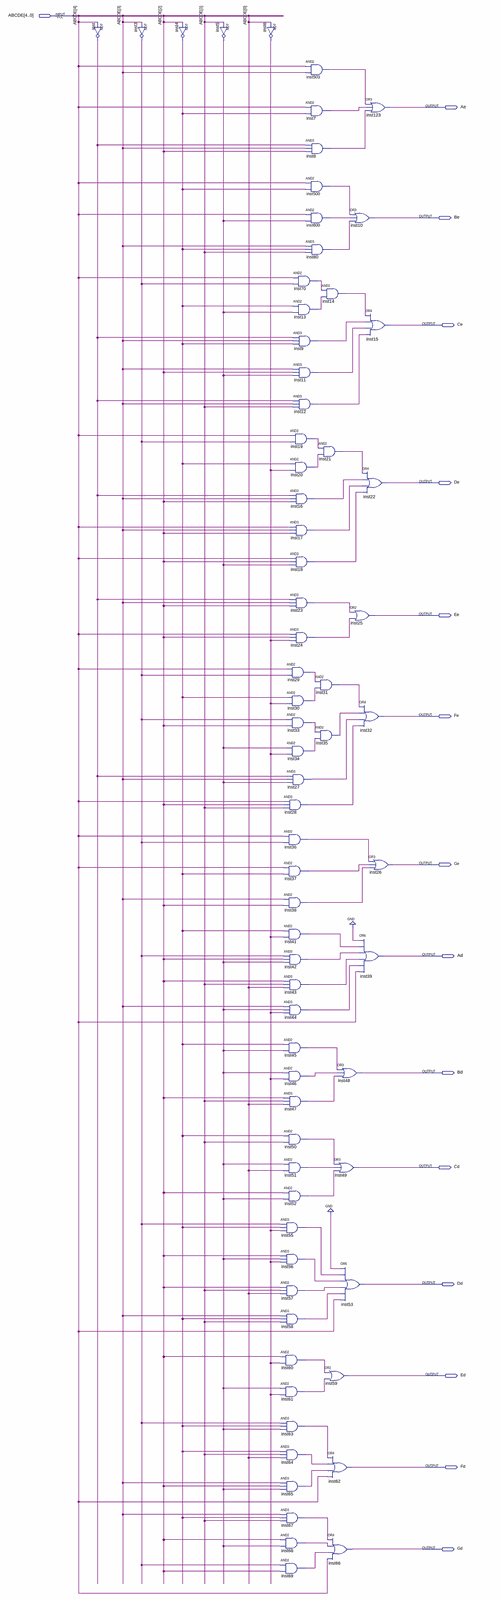
[diagram p0: schematic sheet, whole]
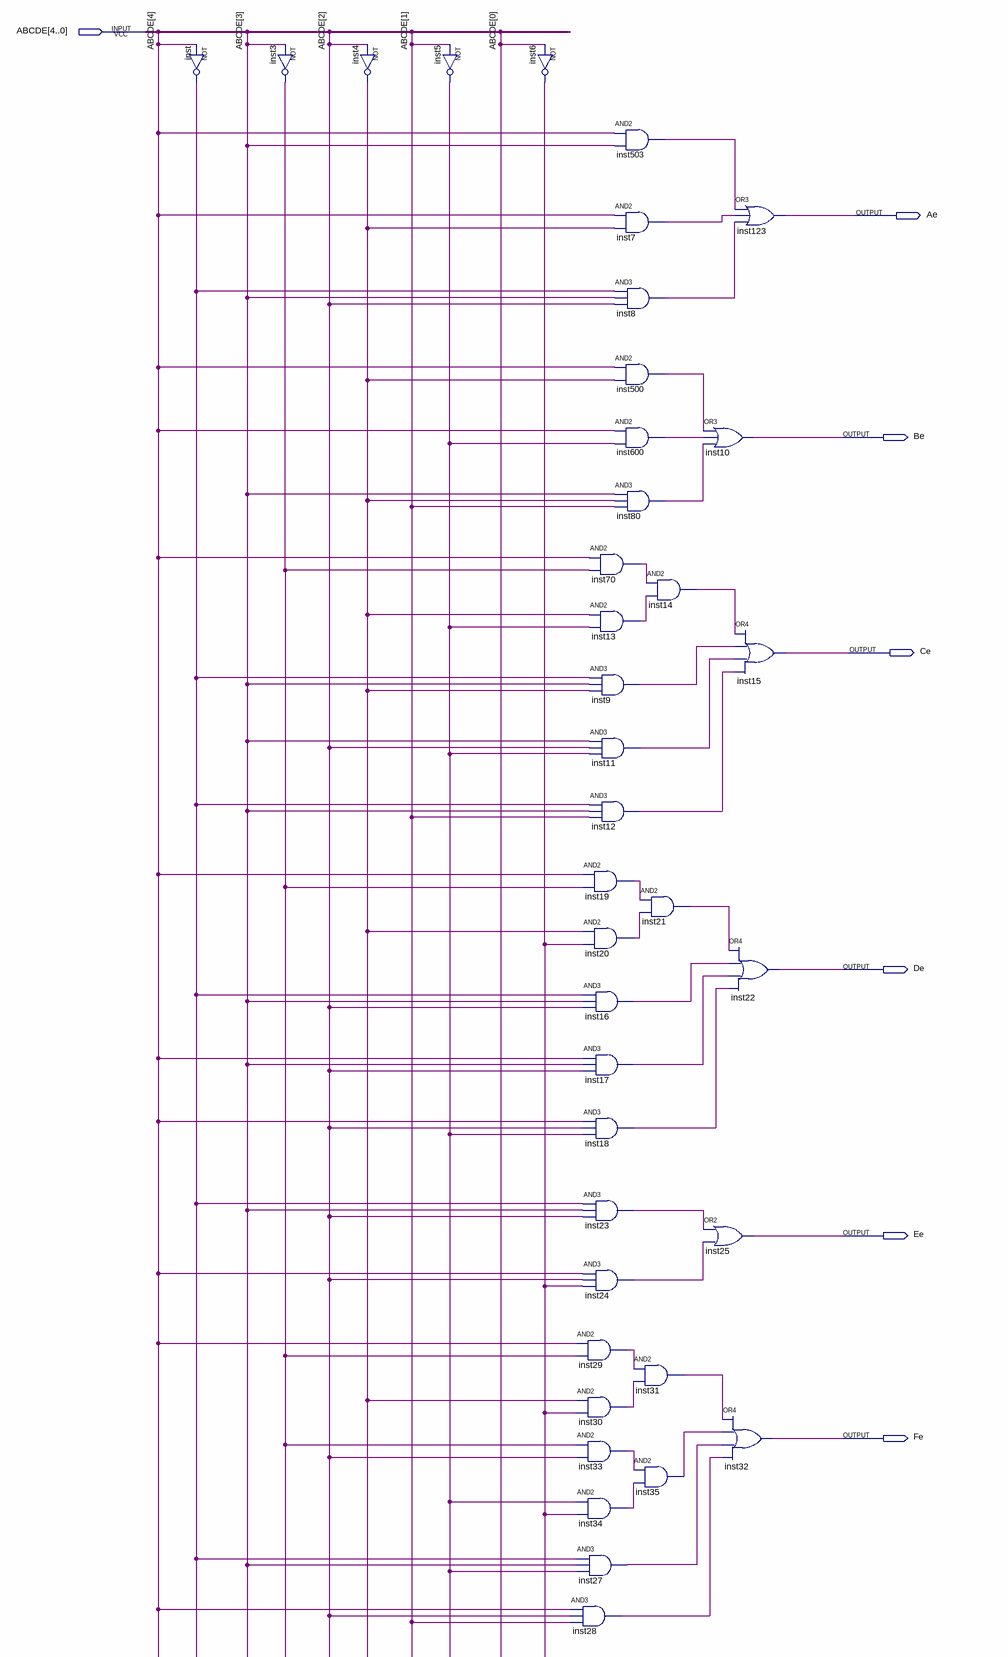
[diagram p1: schematic sheet, upper part]
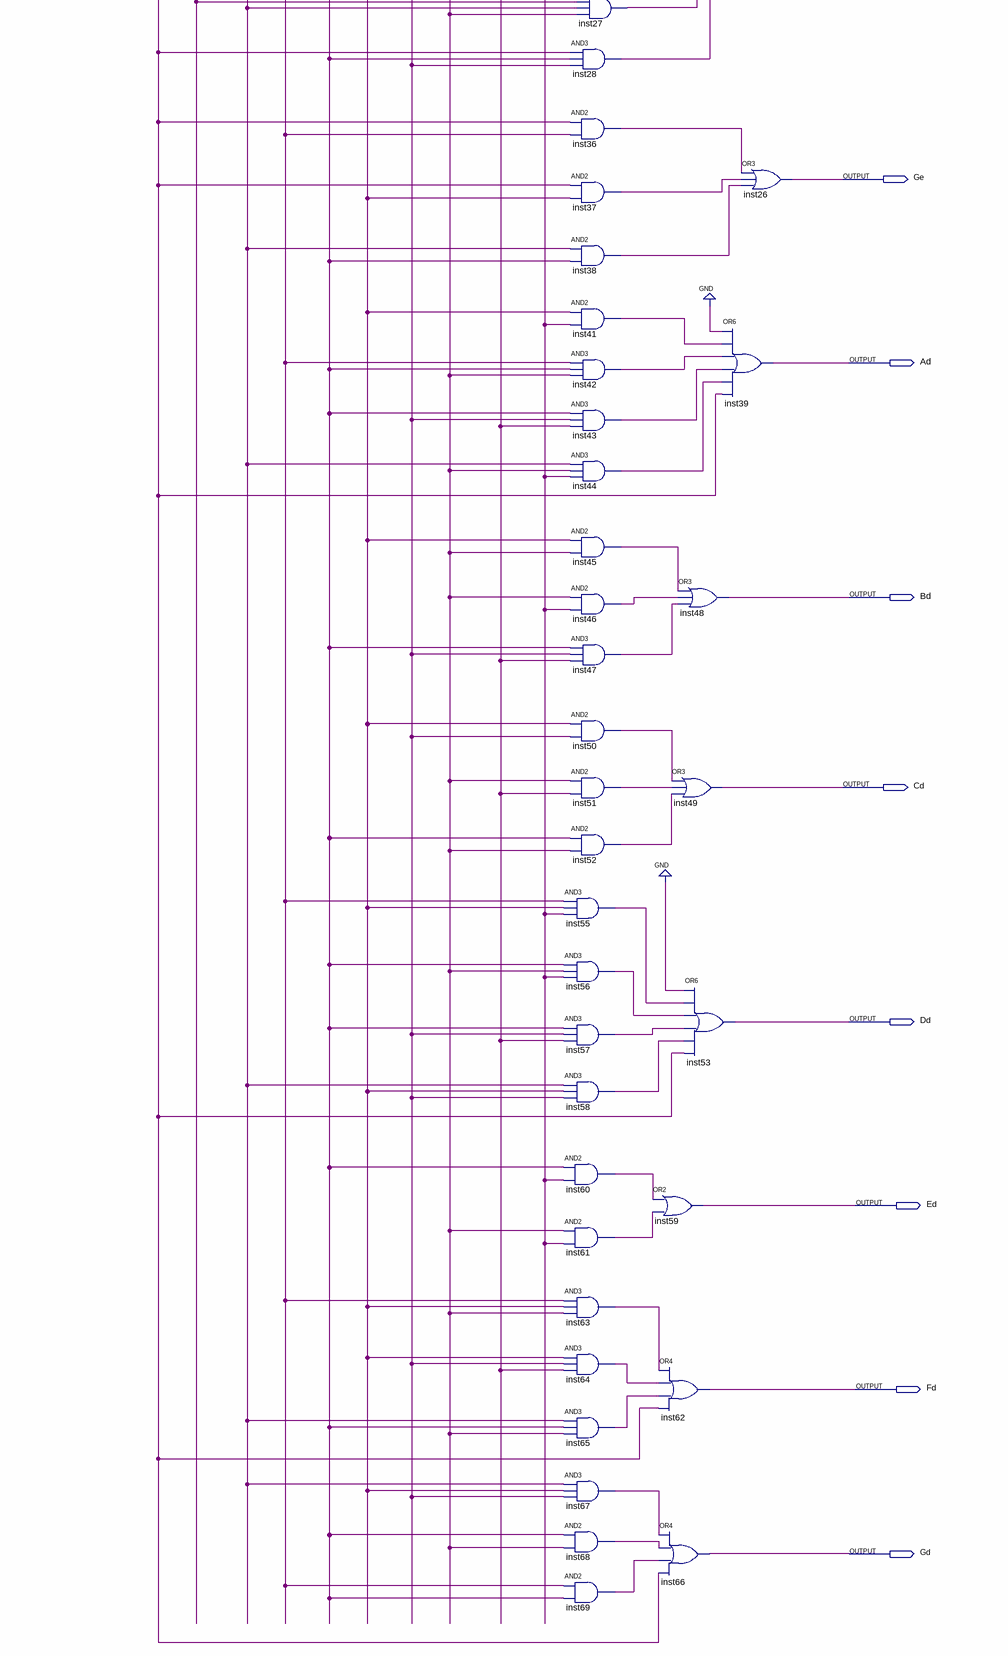
[diagram p2: schematic sheet, lower part]
// Quartus schematic DecodificadorDisplay.bdf as structural Verilog: 72 symbols, 15 pins
module DecodificadorDisplay (
  input  [4:0] ABCDE,
  output Ae,
  output Be,
  output Ce,
  output De,
  output Ee,
  output Fe,
  output Ge,
  output Ad,
  output Bd,
  output Cd,
  output Dd,
  output Ed,
  output Fd,
  output Gd
);

  wire inst3_out, inst4_out, inst5_out, inst6_out, inst7_out, inst8_out, inst9_out, inst11_out, inst12_out,
       inst13_out, inst14_out, inst16_out, inst17_out, inst18_out, inst19_out, inst20_out, inst21_out,
       inst23_out, inst24_out, inst27_out, inst28_out, inst29_out, inst30_out, inst31_out, inst33_out,
       inst34_out, inst35_out, inst36_out, inst37_out, inst38_out, inst41_out, inst42_out, inst43_out,
       inst44_out, inst45_out, inst46_out, inst47_out, inst50_out, inst51_out, inst52_out, inst55_out,
       inst56_out, inst57_out, inst58_out, inst60_out, inst61_out, inst63_out, inst64_out, inst65_out,
       inst67_out, inst68_out, inst69_out, inst70_out, inst80_out, inst500_out, inst503_out, inst600_out,
       inst_out;

  not inst (inst_out, ABCDE[4]);
  not inst3 (inst3_out, ABCDE[3]);
  not inst4 (inst4_out, ABCDE[2]);
  not inst5 (inst5_out, ABCDE[1]);
  not inst6 (inst6_out, ABCDE[0]);
  and inst70 (inst70_out, ABCDE[4], inst3_out);
  and inst13 (inst13_out, inst4_out, inst5_out);
  and inst9 (inst9_out, inst_out, ABCDE[3], inst4_out);
  and inst11 (inst11_out, ABCDE[3], ABCDE[2], inst5_out);
  and inst12 (inst12_out, inst_out, ABCDE[3], ABCDE[1]);
  and inst19 (inst19_out, ABCDE[4], inst3_out);
  and inst20 (inst20_out, inst4_out, inst6_out);
  and inst16 (inst16_out, inst_out, ABCDE[3], ABCDE[2]);
  and inst17 (inst17_out, ABCDE[4], ABCDE[3], ABCDE[2]);
  and inst18 (inst18_out, ABCDE[4], ABCDE[2], inst5_out);
  and inst23 (inst23_out, inst_out, ABCDE[3], ABCDE[2]);
  and inst24 (inst24_out, ABCDE[4], ABCDE[2], inst6_out);
  and inst29 (inst29_out, ABCDE[4], inst3_out);
  and inst30 (inst30_out, inst4_out, inst6_out);
  and inst33 (inst33_out, inst3_out, ABCDE[2]);
  and inst34 (inst34_out, inst5_out, inst6_out);
  and inst27 (inst27_out, inst_out, ABCDE[3], inst5_out);
  and inst28 (inst28_out, ABCDE[4], ABCDE[2], ABCDE[1]);
  and inst36 (inst36_out, ABCDE[4], inst3_out);
  and inst37 (inst37_out, ABCDE[4], inst4_out);
  and inst38 (inst38_out, ABCDE[3], ABCDE[2]);
  and inst41 (inst41_out, inst4_out, inst6_out);
  and inst42 (inst42_out, inst3_out, ABCDE[2], inst5_out);
  and inst43 (inst43_out, ABCDE[2], ABCDE[1], ABCDE[0]);
  and inst44 (inst44_out, ABCDE[3], inst5_out, inst6_out);
  and inst45 (inst45_out, inst4_out, inst5_out);
  and inst46 (inst46_out, inst5_out, inst6_out);
  and inst47 (inst47_out, ABCDE[2], ABCDE[1], ABCDE[0]);
  and inst50 (inst50_out, inst4_out, ABCDE[1]);
  and inst51 (inst51_out, inst5_out, ABCDE[0]);
  and inst52 (inst52_out, ABCDE[2], inst5_out);
  and inst55 (inst55_out, inst3_out, inst4_out, inst6_out);
  and inst56 (inst56_out, ABCDE[2], inst5_out, inst6_out);
  and inst57 (inst57_out, ABCDE[2], ABCDE[1], ABCDE[0]);
  and inst58 (inst58_out, ABCDE[3], inst4_out, ABCDE[1]);
  and inst60 (inst60_out, ABCDE[2], inst6_out);
  and inst61 (inst61_out, inst5_out, inst6_out);
  and inst63 (inst63_out, inst3_out, inst4_out, inst5_out);
  and inst64 (inst64_out, inst4_out, ABCDE[1], ABCDE[0]);
  and inst65 (inst65_out, ABCDE[3], ABCDE[2], inst5_out);
  and inst67 (inst67_out, ABCDE[3], inst4_out, ABCDE[1]);
  and inst68 (inst68_out, ABCDE[2], inst5_out);
  and inst69 (inst69_out, inst3_out, ABCDE[2]);
  and inst503 (inst503_out, ABCDE[4], ABCDE[3]);
  and inst7 (inst7_out, ABCDE[4], inst4_out);
  and inst8 (inst8_out, inst_out, ABCDE[3], ABCDE[2]);
  and inst500 (inst500_out, ABCDE[4], inst4_out);
  and inst600 (inst600_out, ABCDE[4], inst5_out);
  and inst80 (inst80_out, ABCDE[3], inst4_out, ABCDE[1]);
  and inst14 (inst14_out, inst70_out, inst13_out);
  and inst21 (inst21_out, inst19_out, inst20_out);
  and inst31 (inst31_out, inst29_out, inst30_out);
  and inst35 (inst35_out, inst33_out, inst34_out);
  or inst48 (Bd, inst45_out, inst46_out, inst47_out);
  or inst49 (Cd, inst50_out, inst51_out, inst52_out);
  or inst53 (Dd, 1'b0, inst55_out, inst56_out, inst57_out, inst58_out, ABCDE[4]);
  or inst59 (Ed, inst60_out, inst61_out);
  or inst62 (Fd, inst63_out, inst64_out, inst65_out, ABCDE[4]);
  or inst66 (Gd, inst67_out, inst68_out, inst69_out, ABCDE[4]);
  or inst123 (Ae, inst503_out, inst7_out, inst8_out);
  or inst10 (Be, inst500_out, inst600_out, inst80_out);
  or inst15 (Ce, inst14_out, inst9_out, inst11_out, inst12_out);
  or inst22 (De, inst21_out, inst16_out, inst17_out, inst18_out);
  or inst25 (Ee, inst23_out, inst24_out);
  or inst32 (Fe, inst31_out, inst35_out, inst27_out, inst28_out);
  or inst26 (Ge, inst36_out, inst37_out, inst38_out);
  or inst39 (Ad, 1'b0, inst41_out, inst42_out, inst43_out, inst44_out, ABCDE[4]);
endmodule
